# Altium schematic sheet 8500_anger_Y.SchDoc
size A4
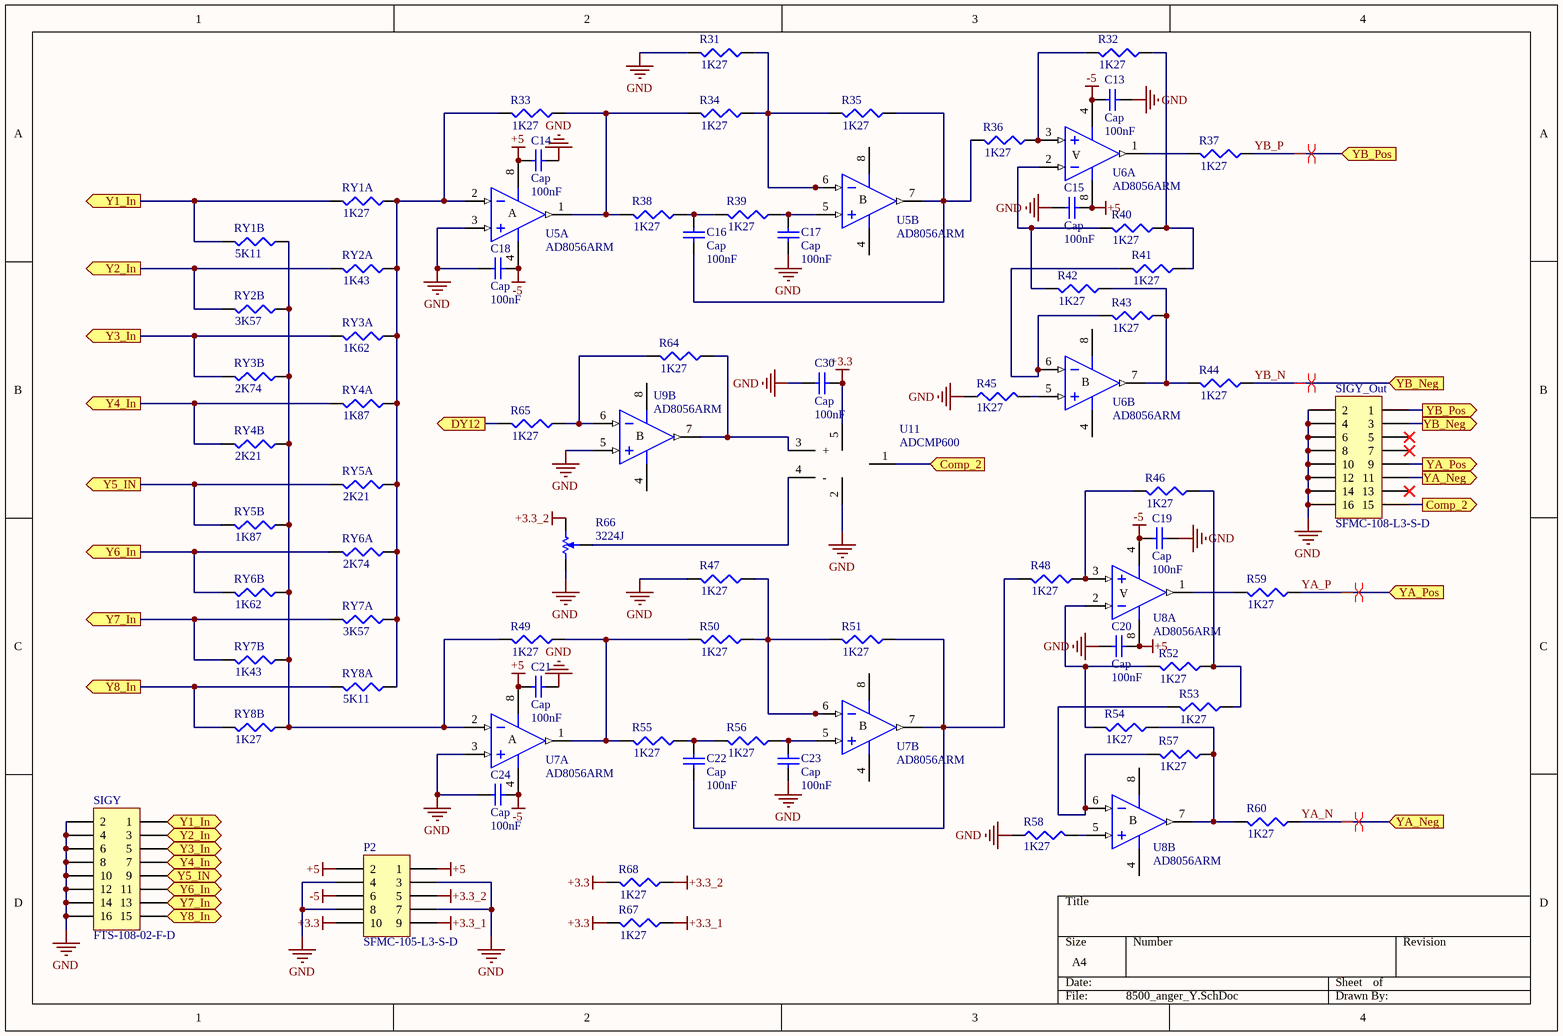
[diagram p0: 8500_anger_Y.SchDoc]

## Parts
C13  Cap  value 100nF  [J1-0603]
C14  Cap  value 100nF  [J1-0603]
C15  Cap  value 100nF  [J1-0603]
C16  Cap  value 100nF  [J1-0603]
C17  Cap  value 100nF  [J1-0603]
C18  Cap  value 100nF  [J1-0603]
C19  Cap  value 100nF  [J1-0603]
C20  Cap  value 100nF  [J1-0603]
C21  Cap  value 100nF  [J1-0603]
C22  Cap  value 100nF  [J1-0603]
C23  Cap  value 100nF  [J1-0603]
C24  Cap  value 100nF  [J1-0603]
C30  Cap  value 100nF  [J1-0603]
P2  SFMC-105-L3-S-D  [MHDR2X5]
R31  value 1K27  [0402]  (hidden comment: Res3)
R32  value 1K27  [0402]  (hidden comment: Res3)
R33  value 1K27  [0402]  (hidden comment: Res3)
R34  value 1K27  [0402]  (hidden comment: Res3)
R35  value 1K27  [0402]  (hidden comment: Res3)
R36  value 1K27  [0402]  (hidden comment: Res3)
R37  value 1K27  [0402]  (hidden comment: Res3)
R38  value 1K27  [0402]  (hidden comment: Res3)
R39  value 1K27  [0402]  (hidden comment: Res3)
R40  value 1K27  [0402]  (hidden comment: Res3)
R41  value 1K27  [0402]  (hidden comment: Res3)
R42  value 1K27  [0402]  (hidden comment: Res3)
R43  value 1K27  [0402]  (hidden comment: Res3)
R44  value 1K27  [0402]  (hidden comment: Res3)
R45  value 1K27  [0402]  (hidden comment: Res3)
R46  value 1K27  [0402]  (hidden comment: Res3)
R47  value 1K27  [0402]  (hidden comment: Res3)
R48  value 1K27  [0402]  (hidden comment: Res3)
R49  value 1K27  [0402]  (hidden comment: Res3)
R50  value 1K27  [0402]  (hidden comment: Res3)
R51  value 1K27  [0402]  (hidden comment: Res3)
R52  value 1K27  [0402]  (hidden comment: Res3)
R53  value 1K27  [0402]  (hidden comment: Res3)
R54  value 1K27  [0402]  (hidden comment: Res3)
R55  value 1K27  [0402]  (hidden comment: Res3)
R56  value 1K27  [0402]  (hidden comment: Res3)
R57  value 1K27  [0402]  (hidden comment: Res3)
R58  value 1K27  [0402]  (hidden comment: Res3)
R59  value 1K27  [0402]  (hidden comment: Res3)
R60  value 1K27  [0402]  (hidden comment: Res3)
R64  value 1K27  [0402]  (hidden comment: Res3)
R65  value 1K27  [0402]  (hidden comment: Res3)
R66  3224J  [POT4MM-2]
R67  value 1K27  [0402]  (hidden comment: Res3)
R68  value 1K27  [0402]  (hidden comment: Res3)
RY1A  value 1K27  [0402]  (hidden comment: Res3)
RY1B  value 5K11  [0402]  (hidden comment: Res3)
RY2A  value 1K43  [0402]  (hidden comment: Res3)
RY2B  value 3K57  [0402]  (hidden comment: Res3)
RY3A  value 1K62  [0402]  (hidden comment: Res3)
RY3B  value 2K74  [0402]  (hidden comment: Res3)
RY4A  value 1K87  [0402]  (hidden comment: Res3)
RY4B  value 2K21  [0402]  (hidden comment: Res3)
RY5A  value 2K21  [0402]  (hidden comment: Res3)
RY5B  value 1K87  [0402]  (hidden comment: Res3)
RY6A  value 2K74  [0402]  (hidden comment: Res3)
RY6B  value 1K62  [0402]  (hidden comment: Res3)
RY7A  value 3K57  [0402]  (hidden comment: Res3)
RY7B  value 1K43  [0402]  (hidden comment: Res3)
RY8A  value 5K11  [0402]  (hidden comment: Res3)
RY8B  value 1K27  [0402]  (hidden comment: Res3)
SIGY  FTS-108-02-F-D  [MHDR2X8]
SIGY_Out  SFMC-108-L3-S-D  [MHDR2X8]
U5  AD8056ARM  [RM-8]  (parts A,B of 2)
U6  AD8056ARM  [RM-8]  (parts A,B of 2)
U7  AD8056ARM  [RM-8]  (parts A,B of 2)
U8  AD8056ARM  [RM-8]  (parts A,B of 2)
U9  AD8056ARM  [RM-8]  (part B of 2)
U11  ADCMP600  [SOT23-5_N]

## Ports
Comp_2 (in), Comp_2 (out), DY12 (out), Y1_In (in), Y1_In (out), Y2_In (in), Y2_In (out), Y3_In (in), Y3_In (out), Y4_In (in), Y4_In (out), Y5_IN (in), Y5_IN (out), Y6_In (in), Y6_In (out), Y7_In (in), Y7_In (out), Y8_In (in), Y8_In (out), YA_Neg (in), YA_Neg (out), YA_Pos (in), YA_Pos (out), YB_Neg (in), YB_Neg (out), YB_Pos (in), YB_Pos (out)

## Nets
+3.3: C30.2 P2.10 R67.2 R68.2 U11.5
+3.3_1: P2.9 R67.1
+3.3_2: P2.5 R66.CW(+) R68.1
+5: C14.1 C15.1 C20.1 C21.1 P2.1 P2.2 U5.8(V+) U6.8(V+) U7.8(V+) U8.8(V+)
-5: C13.1 C18.2 C19.1 C24.2 P2.6 U5.4(V-) U6.4(V-) U7.4(V-) U8.4(V-)
GND: C13.2 C14.2 C15.2 C17.2 C18.1 C19.2 C20.2 C21.2 C23.2 C24.1 C30.1 P2.3 P2.4 P2.7 P2.8 R31.2 R45.1 R47.2 R58.1 R66.CCW(-) SIGY.2 SIGY.4 SIGY.6 SIGY.8 SIGY.10 SIGY.12 SIGY.14 SIGY.16 SIGY_Out.2 SIGY_Out.4 SIGY_Out.6 SIGY_Out.8 SIGY_Out.10 SIGY_Out.12 SIGY_Out.14 SIGY_Out.16 U5.3(IN+) U7.3(IN+) U9.5(IN+) U11.2
Comp_2: SIGY_Out.15 U11.1 ; port Comp_2
DY12: R65.2 ; port DY12
Y1_In: RY1A.2 RY1B.2 SIGY.1 ; port Y1_In
Y2_In: RY2A.2 RY2B.2 SIGY.3 ; port Y2_In
Y3_In: RY3A.2 RY3B.2 SIGY.5 ; port Y3_In
Y4_In: RY4A.2 RY4B.2 SIGY.7 ; port Y4_In
Y5_IN: RY5A.2 RY5B.2 SIGY.9 ; port Y5_IN
Y6_In: RY6A.2 RY6B.2 SIGY.11 ; port Y6_In
Y7_In: RY7A.2 RY7B.2 SIGY.13 ; port Y7_In
Y8_In: RY8A.2 RY8B.2 SIGY.15 ; port Y8_In
YA_N: R60.1 SIGY_Out.11 ; port YA_Neg
YA_P: R59.1 SIGY_Out.9 ; port YA_Pos
YB_N: R44.1 SIGY_Out.3 ; port YB_Neg
YB_P: R37.1 SIGY_Out.1 ; port YB_Pos
NetC16_1: C16.1 R38.1 R39.2
NetC16_2: C16.2 R35.1 R36.2 U5.7(OUT)
NetC17_1: C17.1 R39.1 U5.5(IN+)
NetC22_1: C22.1 R55.1 R56.2
NetC22_2: C22.2 R48.2 R51.1 U7.7(OUT)
NetC23_1: C23.1 R56.1 U7.5(IN+)
NetR31_1: R31.1 R34.1 R35.2 U5.6(IN-)
NetR32_1: R32.1 R40.1 R41.1
NetR32_2: R32.2 R36.1 U6.3(IN+)
NetR33_1: R33.1 R34.2 R38.2 U5.1(OUT)
NetR33_2: R33.2 RY1A.1 RY2A.1 RY3A.1 RY4A.1 RY5A.1 RY6A.1 RY7A.1 RY8A.1 U5.2(IN-)
NetR37_2: R37.2 U6.1(OUT)
NetR40_2: R40.2 R42.2 U6.2(IN-)
NetR41_2: R41.2 R43.2 U6.6(IN-)
NetR42_1: R42.1 R43.1 R44.2 U6.7(OUT)
NetR45_2: R45.2 U6.5(IN+)
NetR46_1: R46.1 R52.1 R53.1
NetR46_2: R46.2 R48.1 U8.3(IN+)
NetR47_1: R47.1 R50.1 R51.2 U7.6(IN-)
NetR49_1: R49.1 R50.2 R55.2 U7.1(OUT)
NetR49_2: R49.2 RY1B.1 RY2B.1 RY3B.1 RY4B.1 RY5B.1 RY6B.1 RY7B.1 RY8B.1 U7.2(IN-)
NetR52_2: R52.2 R54.2 U8.2(IN-)
NetR53_2: R53.2 R57.2 U8.6(IN-)
NetR54_1: R54.1 R57.1 R60.2 U8.7(OUT)
NetR58_2: R58.2 U8.5(IN+)
NetR59_2: R59.2 U8.1(OUT)
NetR64_1: R64.1 U9.7(OUT) U11.3(+)
NetR64_2: R64.2 R65.1 U9.6(IN-)
NetR66_W: R66.W U11.4(-)

Not connected (* = marked no-connect by the designer): SIGY_Out 5* 7* 13*; U9 4(V-) 8(V+)

## Layout directives
differential pair: YA_N, YA_P, YB_N, YB_P

## Notes on the sheet
- (in symbol AD8056ARM, part A) A
- (in symbol AD8056ARM, part B) B

## Library data of the parts
C13-C24 C30 = Cap: Capacitor; Published: 8-Jun-2000; LatestRevisionDate: 17-Jul-2002; LatestRevisionNote: Re-released for DXP Platform.; PackageReference: RAD-0.3; Publisher: Altium Limited; PackageDescription: Radial Cap, Thru-Hole; 2 Leads; 0.3 in Pin Spacing
P2 = FTS-105-02-F-D
R31-R60 R64 R65 R67 R68 RY1A RY1B RY2A RY2B RY3A RY3B RY4A RY4B RY5A RY5B RY6A RY6B RY7A RY7B RY8A RY8B = Res3: Resistor; Published: 8-Jun-2000; LatestRevisionDate: 29-May-2009; LatestRevisionNote: IPC-7351 Footprint Added.; PackageReference: J1-0603; Publisher: Altium Limited; PackageDescription: Chip Resistor
R66 = RPot SM: Square Trimming Potentiometer; Published: 17-Dec-2003; DatasheetVersion: Oct-2003; PackageReference: POT4MM-2; Publisher: Altium Limited; PackageDescription: Square Trimming Potentiometer; ComponentLink1Description: Manufacturer Link; ComponentLink1URL: http://bourns.com/2/search.html
SIGY SIGY_Out = FTR-108-01-D
U5-U9 = AD8056ARM: Low Cost, 300MHz Voltage Feedback Amplifier; Published: 8-Jun-2000; LatestRevisionDate: 04-Mar-2005; LatestRevisionNote: Stylized 3D Model Added, PCB footprint pad width decreased.; DatasheetVersion: REV. 0 1997; PackageVersion: 2004; PackageReference: RM-8; Publisher: Altium Limited; PackageDescription: Shrink Small Outline, MSOP; 8 Leads; Body Width 3 mm; Pitch 0.65 mm; Code_JEDEC: MO-187-AA; ComponentLink1Description: Manufacturer Link; ComponentLink1URL: http://www.analog.com/en/prod/0,,759_786_AD8055%2C00.html; ComponentLink2Description: Datasheet; ComponentLink2URL: http://www.analog.com/UploadedFiles/Data_Sheets/40402558757264AD8055_6_i.pdf